# EAGLE design task8 (EAGLE 9.6.2)
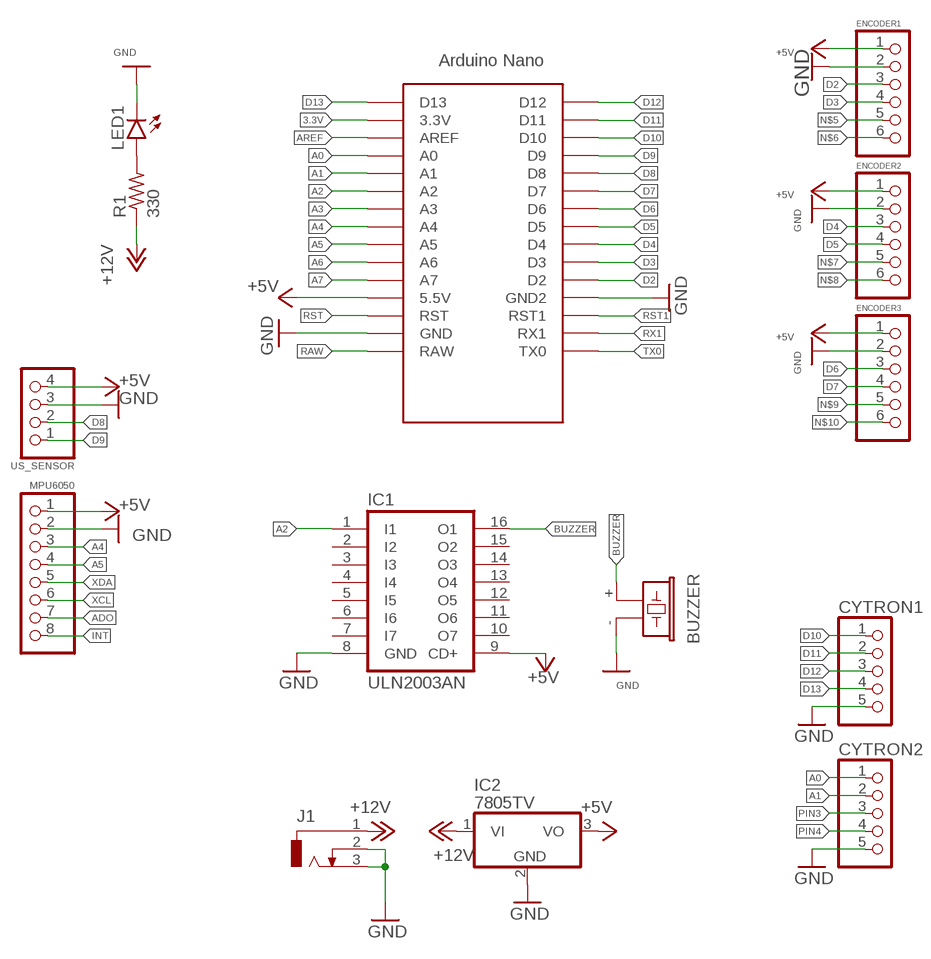
[diagram p0: schematic, sheet 1]

## Parts
CYTRON1  PINHD-1X5  [1X05]
CYTRON2  PINHD-1X5  [1X05]
ENCODER1  PINHD-1X6  [1X06]
ENCODER2  PINHD-1X6  [1X06]
ENCODER3  PINHD-1X6  [1X06]
IC1  ULN2003AN  [DIL16]
IC2  7805TV  [TO220V]
J1  CON_JACK  [DCJ0303]
LED1  LED5MM  [LED5MM]
MPU6050  PINHD-1X8  [1X08]
R1  330  R-US_0204/7  [0204/7]
SG1  BUZZER  [F/CM12P]
U$1  ARDUINO_NANO  [NANO]
US_SENSOR  PINHD-1X4  [1X04]

## Nets
3.3V: U$1.3.3V
+5V: ENCODER1.1 ENCODER2.1 ENCODER3.1 IC1.9(CD+) IC2.3(VO) MPU6050.1 U$1.5V(5.5V) US_SENSOR.4
+12V: IC2.1(VI) J1.1 R1.1
A0: CYTRON2.1 U$1.A0
A1: CYTRON2.2 U$1.A1
A2: IC1.1(I1) U$1.A2
A3: U$1.A3
A4: MPU6050.3 U$1.A4
A5: MPU6050.4 U$1.A5
A6: U$1.A6
A7: U$1.A7
ADO: MPU6050.7
AREF: U$1.AREF
BUZZER: IC1.16(O1) SG1.+
D2: ENCODER1.3 U$1.D2
D3: ENCODER1.4 U$1.D3
D4: ENCODER2.3 U$1.D4
D5: ENCODER2.4 U$1.D5
D6: ENCODER3.3 U$1.D6
D7: ENCODER3.4 U$1.D7
D8: U$1.D8 US_SENSOR.2
D9: U$1.D9 US_SENSOR.1
D10: CYTRON1.1 U$1.D10
D11: CYTRON1.2 U$1.D11
D12: CYTRON1.3 U$1.D12
D13: CYTRON1.4 U$1.D13
GND: CYTRON1.5 CYTRON2.5 ENCODER1.2 ENCODER2.2 ENCODER3.2 IC1.8(GND) IC2.2(GND) J1.2 J1.3 LED1.K(C) MPU6050.2 SG1.- U$1.GND U$1.GND1(GND2) US_SENSOR.3
INT: MPU6050.8
N$1: LED1.A R1.2
N$5: ENCODER1.5
N$6: ENCODER1.6
N$7: ENCODER2.5
N$8: ENCODER2.6
N$9: ENCODER3.5
N$10: ENCODER3.6
PIN3: CYTRON2.3
PIN4: CYTRON2.4
RAW: U$1.RAW
RST: U$1.RST
RST1: U$1.RST1
RX1: U$1.RX1
TX0: U$1.TX0
XCL: MPU6050.6
XDA: MPU6050.5
Unconnected: IC1.2(I2) IC1.3(I3) IC1.4(I4) IC1.5(I5) IC1.6(I6) IC1.7(I7) IC1.10(O7) IC1.11(O6) IC1.12(O5) IC1.13(O4) IC1.14(O3) IC1.15(O2)

## Library data of the parts
CYTRON1 CYTRON2 = MIA-Training:PINHD-1X5: PIN HEADER
ENCODER1-ENCODER3 = MIA-Training:PINHD-1X6: PIN HEADER
IC1 = MIA-Training:ULN2003A: DRIVER ARRAY
IC2 = linear:78*: Positive VOLTAGE REGULATOR Source: http://cache.national.com/ds/LM/LM78L05.pdf http://www.fairchildsemi.com/ds/LM/LM7805.pdf
J1 = MIA-Training:CON_JACK: DC POWER JACK Source: DCJ0303.pdf; OC_FARNELL: unknown; OC_NEWARK: unknown
LED1 = led:LED: LED OSRAM: - CHIPLED LG R971, LG N971, LY N971, LG Q971, LY Q971, LO R971, LY R971 LH N974, LH R974 LS Q976, LO Q976, LY Q976 LO Q996 - Hyper CHIPLED LW Q18S LB Q993, LB Q99A, LB R99A - SideLED LS A670, LO A670, LY A670, LG A670, LP A670 LB A673, LV A673, LT A673, LW A673 LH A674 LY A675 LS A676, LA A676, LO A676, LY A676, LW A676 LS A679, LY A679, LG A679 - Hyper Micro SIDELED® LS Y876, LA Y876, LO Y876, LY Y876 LT Y87S - SmartLED LW L88C, LW L88S LB L89C, LB L89S, LG L890 LS L89K, LO L89K, LY L89K LS L896, LA L896, LO L896, LY L896 - TOPLED LS T670, LO T670, LY T670, LG T670, LP T670 LSG T670, LSP T670, LSY T670, LOP T670, LYG T670 LG T671, LOG T671, LSG T671 LB T673, LV T673, LT T673, LW T673 LH T674 LS T676, LA T676, LO T676, LY T676, LB T676, LH T676, LSB T676, LW T676 LB T67C, LV T67C, LT T67C, LS T67K, LO T67K, LY T67K, LW E67C LS E67B, LA E67B, LO E67B, LY E67B, LB E67C, LV E67C, LT E67C LW T67C LS T679, LY T679, LG T679 LS T770, LO T770, LY T770, LG T770, LP T770 LB T773, LV T773, LT T773, LW T773 LH T774 LS E675, LA E675, LY E675, LS T675 LS T776, LA T776, LO T776, LY T776, LB T776 LHGB T686 LT T68C, LB T68C - Hyper Mini TOPLED® LB M676 - Mini TOPLED Santana® LG M470 LS M47K, LO M47K, LY M47K Source: http://www.osram.convergy.de LUXEON: - LUMILED® LXK2-PW12-R00, LXK2-PW12-S00, LXK2-PW14-U00, LXK2-PW14-V00 LXK2-PM12-R00, LXK2-PM12-S00, LXK2-PM14-U00 LXK2-PE12-Q00, LXK2-PE12-R00, LXK2-PE12-S00, LXK2-PE14-T00, LXK2-PE14-U00 LXK2-PB12-K00, LXK2-PB12-L00, LXK2-PB12-M00, LXK2-PB14-N00, LXK2-PB14-P00, LXK2-PB14-Q00 LXK2-PR12-L00, LXK2-PR12-M00, LXK2-PR14-Q00, LXK2-PR14-R00 LXK2-PD12-Q00, LXK2-PD12-R00, LXK2-PD12-S00 LXK2-PH12-R00, LXK2-PH12-S00 LXK2-PL12-P00, LXK2-PL12-Q00, LXK2-PL12-R00 Source: www.luxeon.com KINGBRIGHT: KA-3528ASYC Source: www.kingbright.com
MPU6050 = MIA-Training:PINHD-1X8: PIN HEADER
R1 = rcl:R-US_: RESISTOR, American symbol; SPICEPREFIX: R
SG1 = MIA-Training:BUZZER: BUZZER Source: Buerklin; OC_FARNELL: unknown; OC_NEWARK: unknown
U$1 = MIA-Training:ARDUINO_NANO: Arduino Nano
US_SENSOR = MIA-Training:PINHD-1X4: PIN HEADER

## Board
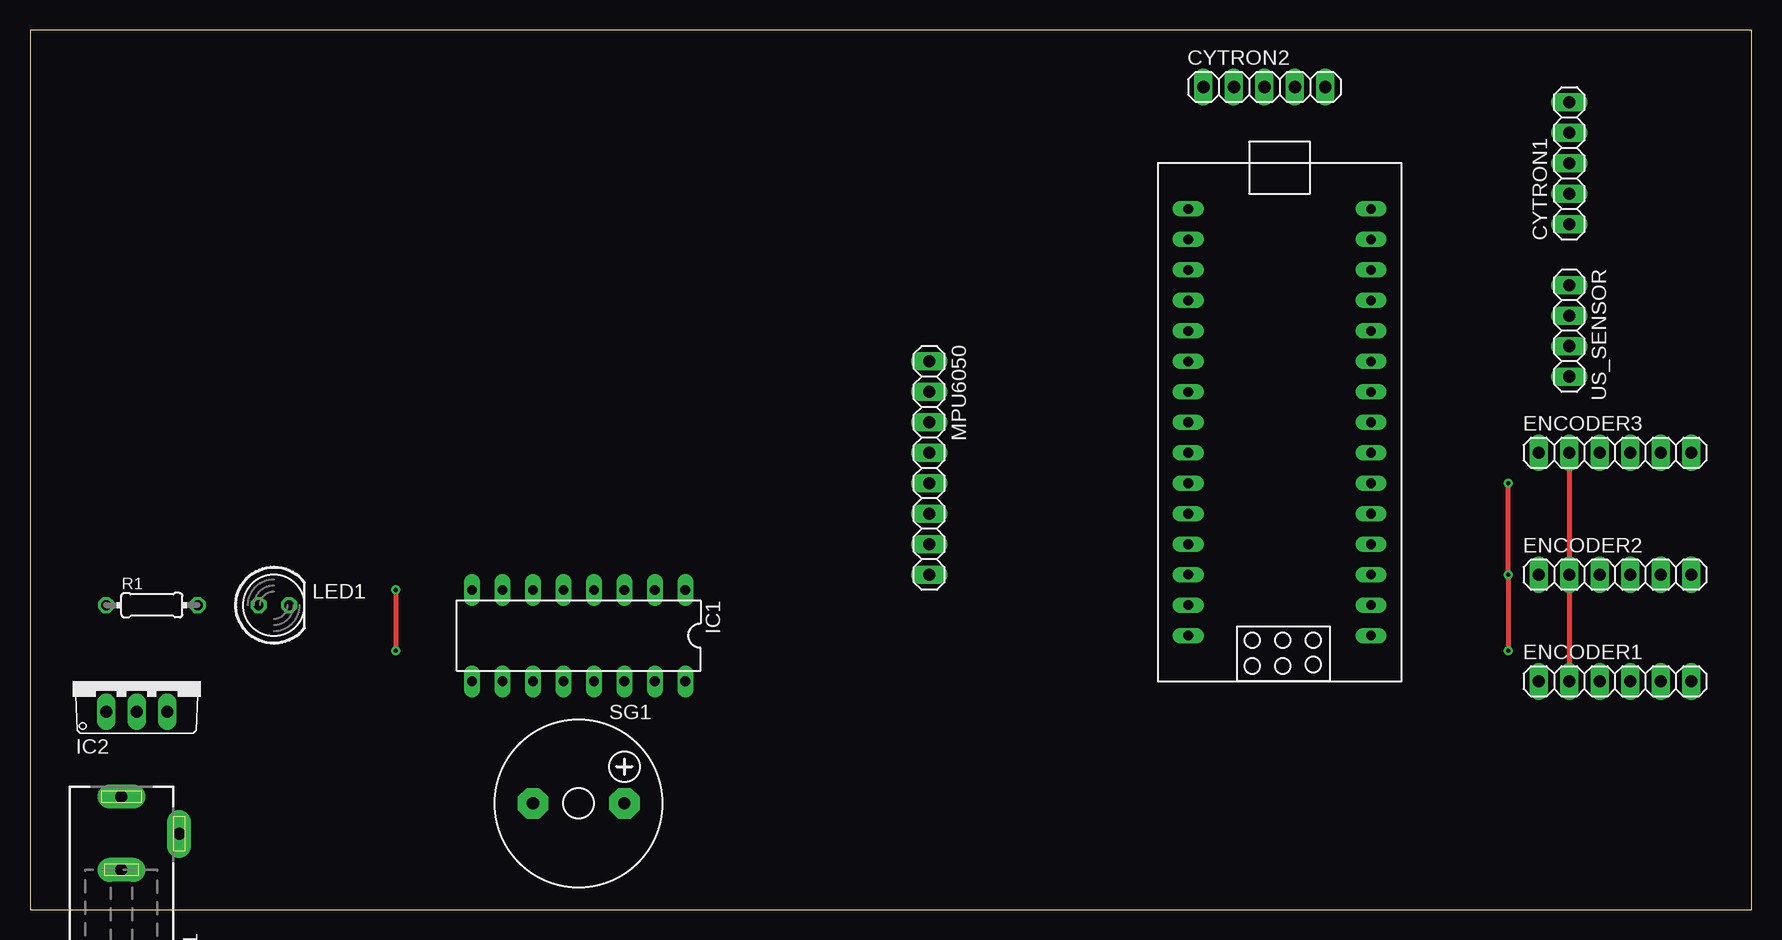
[diagram p1: board, top side]
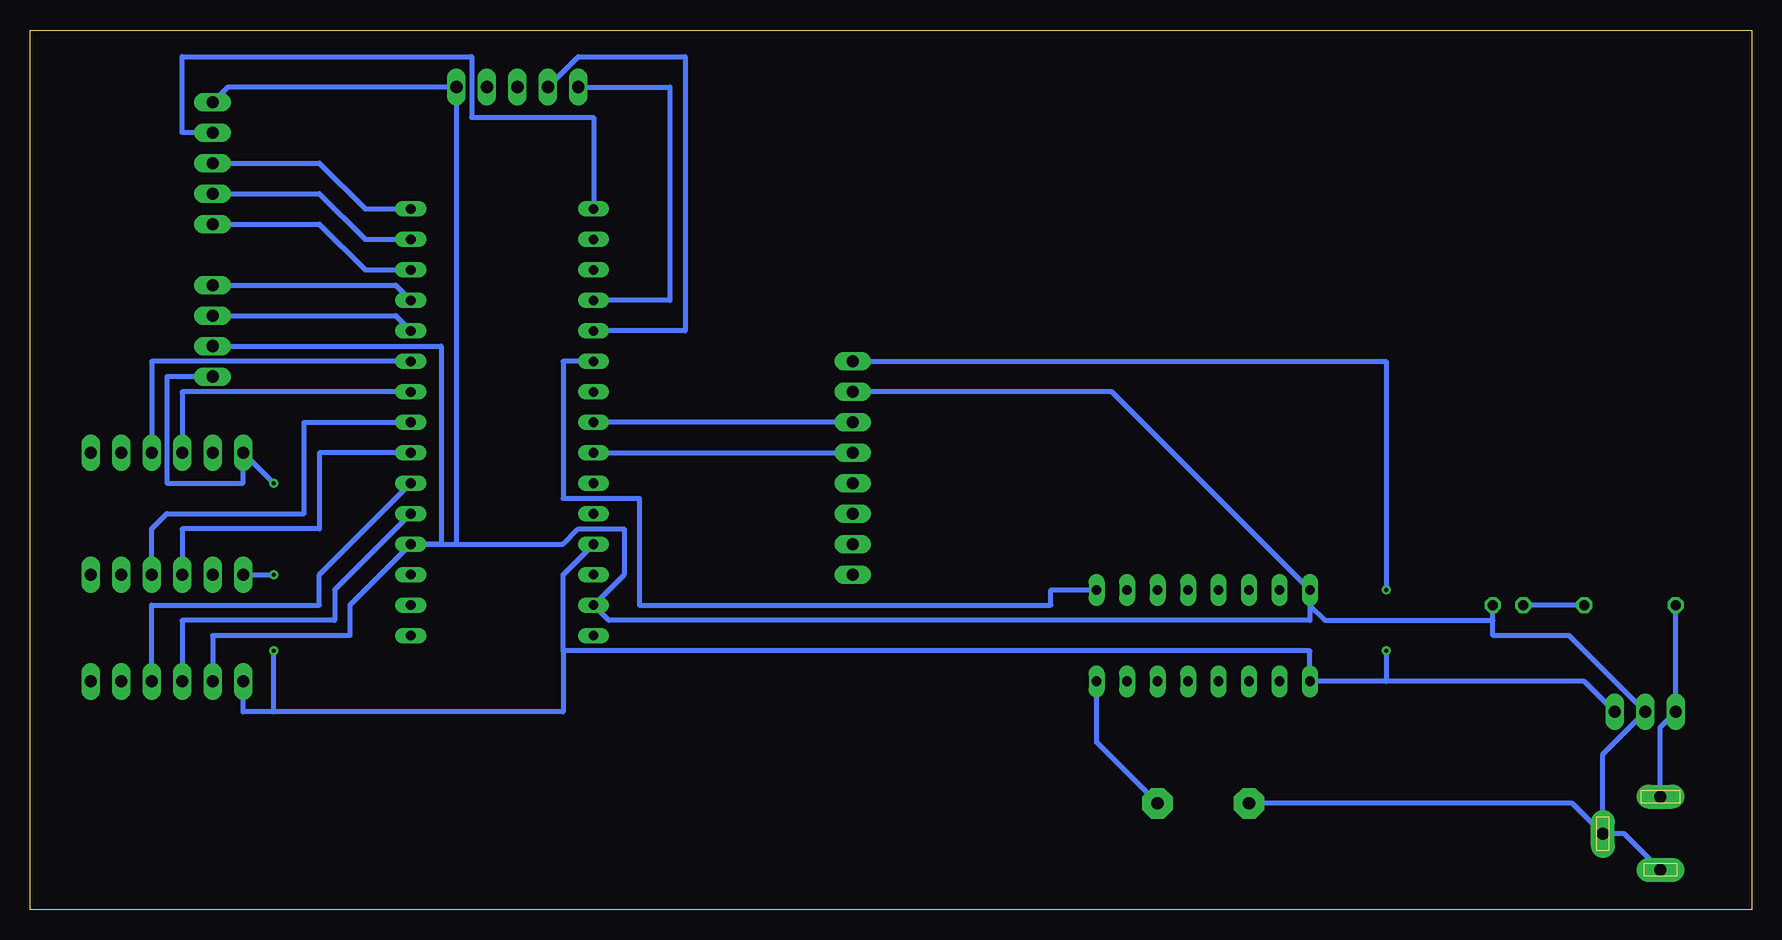
[diagram p2: board, bottom side, seen from below]

Size 143.49 x 73.33 mm. Coordinates in mm from the lower left corner, seen from the top.
Outline: 0,0 143.49,0 143.49,73.33 0,73.33 0,0
Copper layers (1*16): Top 0.035mm / dielectric 1.5mm / Bottom 0.035mm
Design rules "default": minimum track width 6mil, minimum drill 0.35mm, track to track 6mil, track to pad 6mil, pad to pad 6mil, via to via 6mil, smd to smd 6mil, copper to edge 40mil, drill to drill 6mil, minimum pad ring 10mil, minimum via ring 8mil, stop-mask expansion 4mil, vias tented up to drill 0mil, thermal gap 10mil

### Footprints (pad centres in the part's own frame; a part is rotated, then mirrored left to right if it is on the bottom)
1X05 = drill 1.016 long: 1 -5.08,0; 2 -2.54,0; 3 0,0; 4 2.54,0; 5 5.08,0
1X06 = drill 1.016 long: 1 -6.35,0; 2 -3.81,0; 3 -1.27,0; 4 1.27,0; 5 3.81,0; 6 6.35,0
DIL16 = drill 0.813 long: 1 -8.89,-3.81; 2 -6.35,-3.81; 3 -3.81,-3.81; 4 -1.27,-3.81; 5 1.27,-3.81; 6 3.81,-3.81; 7 6.35,-3.81; 8 8.89,-3.81; 9 8.89,3.81; 10 6.35,3.81; 11 3.81,3.81; 12 1.27,3.81; 13 -1.27,3.81; 14 -3.81,3.81; 15 -6.35,3.81; 16 -8.89,3.81
TO220V = drill 1.016 long: 1 -2.54,-2.54; 2 0,-2.54; 3 2.54,-2.54
DCJ0303 = drill 1 pad 2 long: 1 0,3.1; 2 4.8,0; 3 0,-3
LED5MM = drill 0.813 octagon: A -1.27,0; K 1.27,0
1X08 = drill 1.016 long: 1 -8.89,0; 2 -6.35,0; 3 -3.81,0; 4 -1.27,0; 5 1.27,0; 6 3.81,0; 7 6.35,0; 8 8.89,0
0204/7 = drill 0.813 octagon: 1 -3.81,0; 2 3.81,0
F/CM12P = drill 1.016 pad 2.54 octagon: + 3.81,0; - -3.81,0
NANO = drill 0.8 long: 3.3V -10.16,24.13; 5V -10.16,-1.27; A0 -10.16,19.05; A1 -10.16,16.51; A2 -10.16,13.97; A3 -10.16,11.43; A4 -10.16,8.89; A5 -10.16,6.35; A6 -10.16,3.81; A7 -10.16,1.27; AREF -10.16,21.59; D2 5.08,1.27; D3 5.08,3.81; D4 5.08,6.35; D5 5.08,8.89; D6 5.08,11.43; D7 5.08,13.97; D8 5.08,16.51; D9 5.08,19.05; D10 5.08,21.59; D11 5.08,24.13; D12 5.08,26.67; D13 -10.16,26.67; GND -10.16,-6.35; GND1 5.08,-1.27; RAW -10.16,-8.89; RST -10.16,-3.81; RST1 5.08,-3.81; RX1 5.08,-6.35; TX0 5.08,-8.89
1X04 = drill 1.016 long: 1 -3.81,0; 2 -1.27,0; 3 1.27,0; 4 3.81,0

### Placement (x,y rotation side)
CYTRON1  128.27,62.23 90 top
CYTRON2  102.87,68.58 0 top
ENCODER1  132.08,19.05 0 top
ENCODER2  132.08,27.94 0 top
ENCODER3  132.08,38.1 0 top
IC1  45.72,22.86 180 top
IC2  8.89,19.05 0 top
J1  7.62,6.35 0 top
LED1  20.32,25.4 0 top
MPU6050  74.93,36.83 270 top
R1  10.16,25.4 0 top
SG1  45.72,8.89 0 top
U$1  106.68,31.75 0 top
US_SENSOR  128.27,48.26 270 top

### Tracks (layer width: path | path; a pad name or v marks a point on that pad's centre or on a via)
+5V  (via drill 0.35)
  Top 0.406: v123.19,35.56 v123.19,27.94 v123.19,21.59 | v30.48,26.67 v30.48,21.59
  Bottom 0.406: IC2.3 13.97,19.05 30.48,19.05 | 30.48,19.05 IC1.9 36.83,21.59 99.06,21.59 | 99.06,21.59 99.06,27.94 U$1.5V | 99.06,21.59 99.06,16.51 123.19,16.51 | 123.19,16.51 125.73,16.51 ENCODER1.1 | v123.19,35.56 ENCODER3.1 125.73,35.56 132.08,35.56 132.08,44.45 US_SENSOR.4 | ENCODER2.1 v123.19,27.94 | 123.19,16.51 v123.19,21.59 | MPU6050.1 30.48,45.72 v30.48,26.67 | v30.48,21.59 30.48,19.05
+12V
  Bottom 0.406: J1.1 7.62,15.24 IC2.1 R1.1
A0
  Bottom 0.406: CYTRON2.1 90.17,68.58 90.17,50.8 U$1.A0
A1
  Bottom 0.406: CYTRON2.2 97.79,71.12 88.9,71.12 88.9,48.26 U$1.A1
A2
  Bottom 0.406: U$1.A2 99.06,45.72 99.06,34.29 92.71,34.29 92.71,25.4 58.42,25.4 58.42,26.67 IC1.1
A4
  Bottom 0.406: MPU6050.3 U$1.A4
A5
  Bottom 0.406: U$1.A5 MPU6050.4
BUZZER
  Bottom 0.406: SG1.+ 54.61,13.97 IC1.16
D2
  Bottom 0.406: U$1.D2 118.11,26.67 118.11,24.13 130.81,24.13 ENCODER1.3
D3
  Bottom 0.406: ENCODER1.4 133.35,25.4 119.38,25.4 119.38,27.94 U$1.D3
D4
  Bottom 0.406: 113.03,38.1 U$1.D4 119.38,38.1 119.38,31.75 130.81,31.75 ENCODER2.3
D5
  Bottom 0.406: ENCODER2.4 133.35,31.75 132.08,33.02 120.65,33.02 120.65,40.64 U$1.D5
D6
  Bottom 0.406: U$1.D6 130.81,43.18 ENCODER3.3
D7
  Bottom 0.406: U$1.D7 133.35,45.72 ENCODER3.4
D8
  Bottom 0.406: US_SENSOR.2 113.03,49.53 U$1.D8
D9
  Bottom 0.406: US_SENSOR.1 113.03,52.07 U$1.D9
D10
  Bottom 0.406: CYTRON1.1 119.38,57.15 115.57,53.34 U$1.D10
D11
  Bottom 0.406: CYTRON1.2 119.38,59.69 115.57,55.88 U$1.D11
D12
  Bottom 0.406: CYTRON1.3 119.38,62.23 115.57,58.42 U$1.D12
D13
  Bottom 0.406: CYTRON1.4 130.81,64.77 130.81,71.12 106.68,71.12 106.68,66.04 96.52,66.04 U$1.D13
GND
  Top 0.406: ENCODER3.2 ENCODER2.2 ENCODER1.2
  Bottom 0.152: J1.3 8.08,3.81 8.89,3.81
  Bottom 0.406: J1.3 10.62,6.35 J1.2 | J1.2 12.42,12.98 IC2.2 15.24,22.86 21.59,22.86 LED1.K 21.59,24.13 35.56,24.13 36.83,25.4 IC1.8 | J1.2 14.96,8.89 SG1.- | IC1.8 53.34,43.18 MPU6050.2 | CYTRON1.5 127,68.58 CYTRON2.5 107.95,30.48 109.22,30.48 | 109.22,30.48 U$1.GND1 | US_SENSOR.3 109.22,46.99 109.22,30.48 | IC1.8 36.83,24.13 95.25,24.13 U$1.GND 93.98,27.94 93.98,31.75 97.79,31.75 99.06,30.48 U$1.GND1 | U$1.GND1 116.84,25.4 116.84,22.86 128.27,22.86 ENCODER1.2
N$1
  Bottom 0.406: R1.2 LED1.A